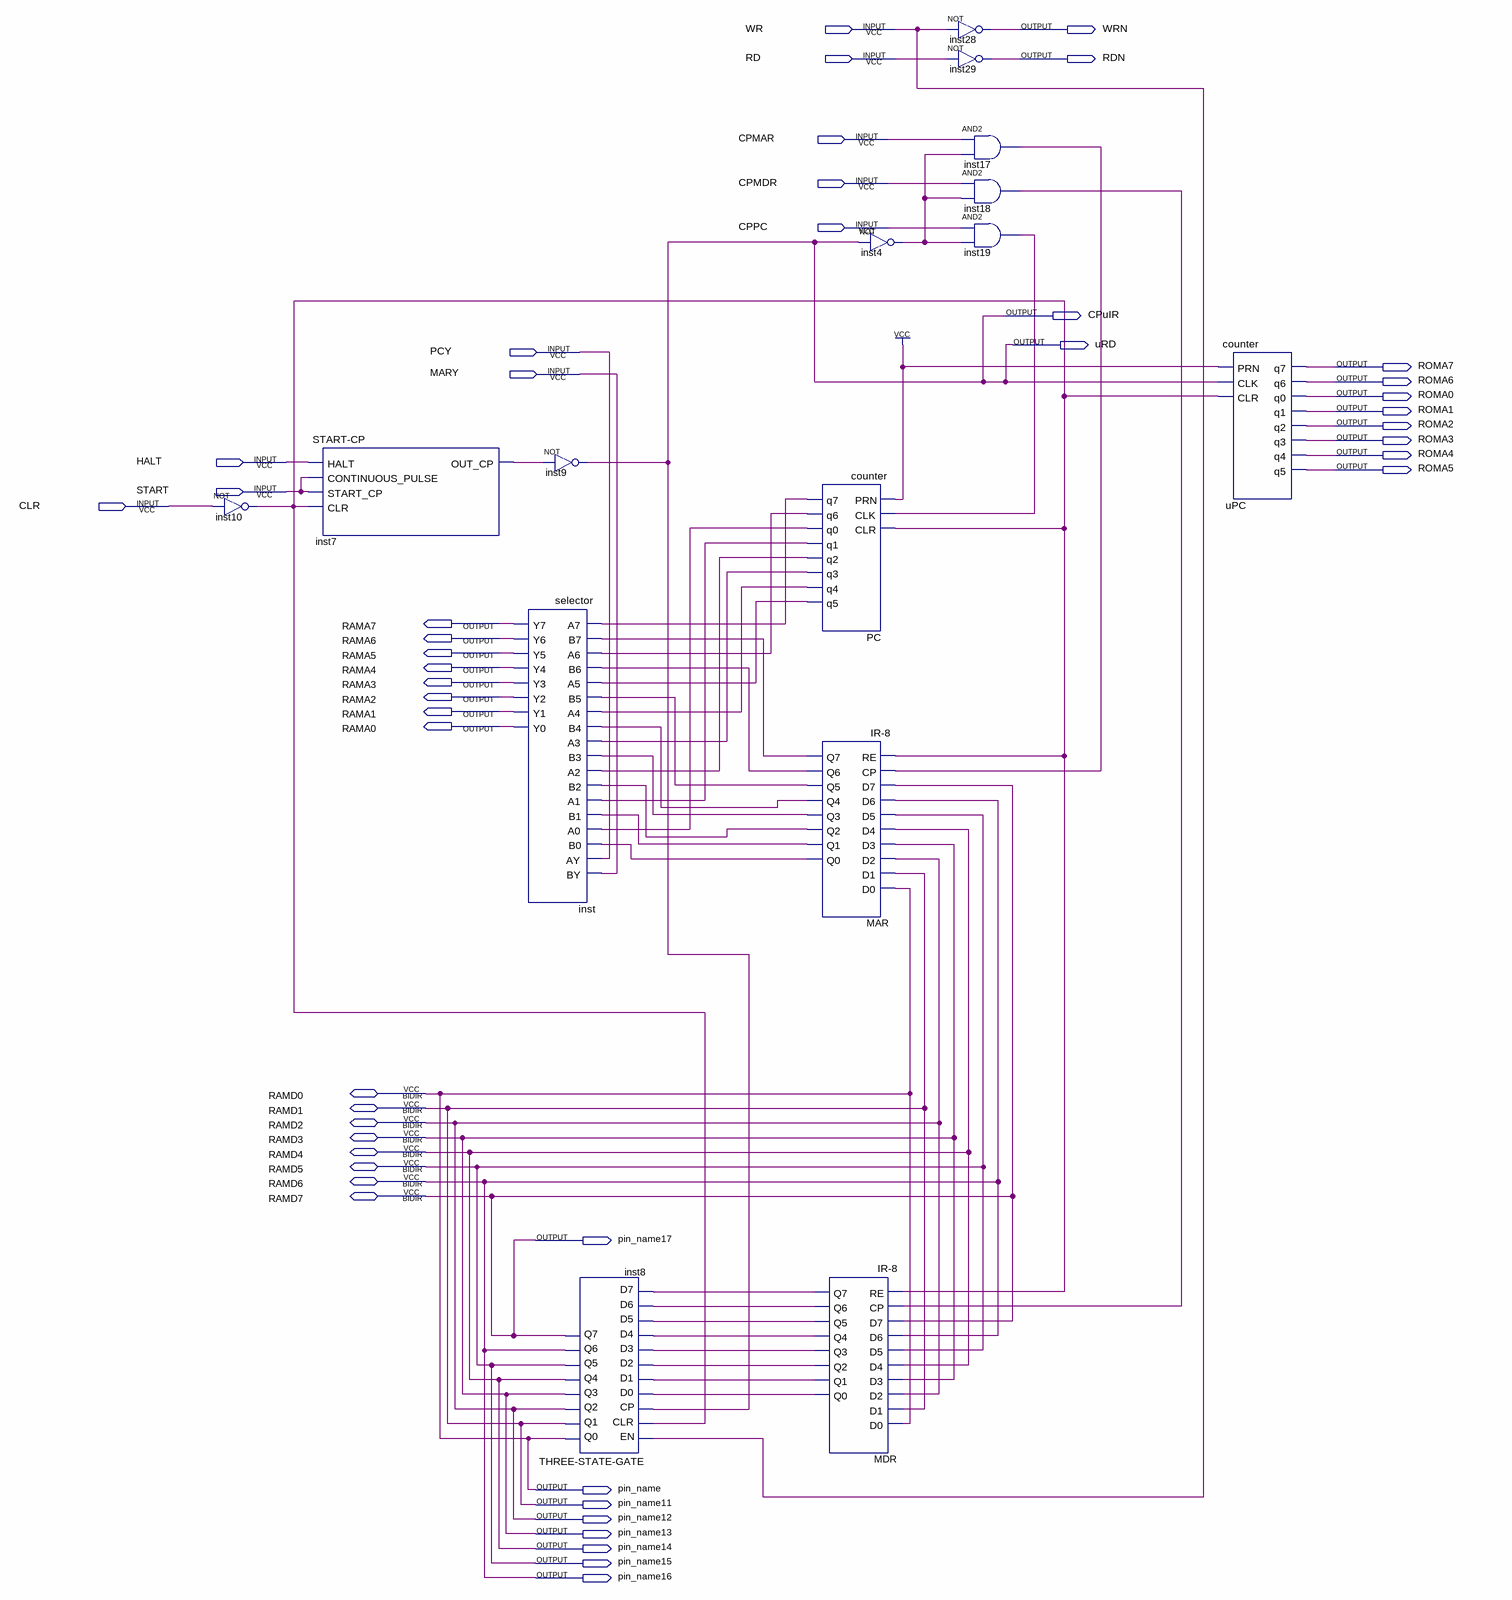
[diagram p0: schematic sheet]
// Quartus schematic FANGCUN-SYSTEM.bdf as structural Verilog: 15 symbols, 46 pins
module \FANGCUN-SYSTEM  (
  input  WR,
  input  RD,
  input  CPMAR,
  input  CPMDR,
  input  CPPC,
  input  PCY,
  input  MARY,
  input  HALT,
  input  START,
  input  CLR,
  inout  RAMD0,
  inout  RAMD1,
  inout  RAMD2,
  inout  RAMD3,
  inout  RAMD4,
  inout  RAMD5,
  inout  RAMD6,
  inout  RAMD7,
  output WRN,
  output RDN,
  output CPuIR,
  output uRD,
  output ROMA7,
  output ROMA6,
  output ROMA0,
  output ROMA1,
  output ROMA2,
  output ROMA3,
  output ROMA4,
  output ROMA5,
  output RAMA7,
  output RAMA6,
  output RAMA5,
  output RAMA4,
  output RAMA3,
  output RAMA2,
  output RAMA1,
  output RAMA0,
  output pin_name17,
  output pin_name,
  output pin_name11,
  output pin_name12,
  output pin_name13,
  output pin_name14,
  output pin_name15,
  output pin_name16
);

  wire inst4_out, inst7_out_cp, inst10_out, inst17_out, inst18_out, inst19_out, MAR_q0, MAR_q1, MAR_q2,
       MAR_q3, MAR_q4, MAR_q5, MAR_q6, MAR_q7, MDR_q0, MDR_q1, MDR_q2, MDR_q3, MDR_q4, MDR_q5, MDR_q6,
       MDR_q7, PC_q0, PC_q1, PC_q2, PC_q3, PC_q4, PC_q5, PC_q6, PC_q7;

  not inst10 (inst10_out, CLR);
  \START-CP  inst7 (.HALT(HALT), .CONTINUOUS_PULSE(START), .START_CP(START), .CLR(inst10_out), .OUT_CP(inst7_out_cp));
  not inst9 (CPuIR, inst7_out_cp);
  selector inst (
    .A7(PC_q7), .B7(MAR_q7), .A6(PC_q6), .B6(MAR_q6), .A5(PC_q5), .B5(MAR_q5), .A4(PC_q4), .B4(MAR_q4),
    .A3(PC_q3), .B3(MAR_q3), .A2(PC_q2), .B2(MAR_q2), .A1(PC_q1), .B1(MAR_q1), .A0(PC_q0), .B0(MAR_q0),
    .AY(PCY), .BY(MARY), .Y7(RAMA7), .Y6(RAMA6), .Y5(RAMA5), .Y4(RAMA4), .Y3(RAMA3), .Y2(RAMA2), .Y1(RAMA1),
    .Y0(RAMA0));
  \THREE-STATE-GATE  inst8 (
    .EN(WR), .CLR(inst10_out), .CP(CPuIR), .D0(MDR_q0), .D1(MDR_q1), .D2(MDR_q2), .D3(MDR_q3), .D4(MDR_q4),
    .D5(MDR_q5), .D6(MDR_q6), .D7(MDR_q7), .Q0(RAMD0), .Q1(RAMD1), .Q2(RAMD2), .Q3(RAMD3), .Q4(RAMD4),
    .Q5(RAMD5), .Q6(RAMD6), .Q7(RAMD7));
  not inst4 (inst4_out, CPuIR);
  counter PC (
    .PRN(1'b1), .CLK(inst19_out), .CLR(inst10_out), .q7(PC_q7), .q6(PC_q6), .q0(PC_q0), .q1(PC_q1),
    .q2(PC_q2), .q3(PC_q3), .q4(PC_q4), .q5(PC_q5));
  \IR-8  MAR (
    .RE(inst10_out), .CP(inst17_out), .D7(RAMD7), .D6(RAMD6), .D5(RAMD5), .D4(RAMD4), .D3(RAMD3), .D2(RAMD2),
    .D1(RAMD1), .D0(RAMD0), .Q7(MAR_q7), .Q6(MAR_q6), .Q5(MAR_q5), .Q4(MAR_q4), .Q3(MAR_q3), .Q2(MAR_q2),
    .Q1(MAR_q1), .Q0(MAR_q0));
  \IR-8  MDR (
    .RE(inst10_out), .CP(inst18_out), .D7(RAMD7), .D6(RAMD6), .D5(RAMD5), .D4(RAMD4), .D3(RAMD3), .D2(RAMD2),
    .D1(RAMD1), .D0(RAMD0), .Q7(MDR_q7), .Q6(MDR_q6), .Q5(MDR_q5), .Q4(MDR_q4), .Q3(MDR_q3), .Q2(MDR_q2),
    .Q1(MDR_q1), .Q0(MDR_q0));
  not inst28 (WRN, WR);
  not inst29 (RDN, RD);
  and inst17 (inst17_out, CPMAR, inst4_out);
  and inst18 (inst18_out, CPMDR, inst4_out);
  and inst19 (inst19_out, CPPC, inst4_out);
  counter uPC (
    .PRN(1'b1), .CLK(CPuIR), .CLR(inst10_out), .q7(ROMA7), .q6(ROMA6), .q0(ROMA0), .q1(ROMA1), .q2(ROMA2),
    .q3(ROMA3), .q4(ROMA4), .q5(ROMA5));

  assign pin_name = RAMD0;
  assign pin_name11 = RAMD1;
  assign pin_name12 = RAMD2;
  assign pin_name13 = RAMD3;
  assign pin_name14 = RAMD4;
  assign pin_name15 = RAMD5;
  assign pin_name16 = RAMD6;
  assign pin_name17 = RAMD7;
  assign uRD = CPuIR;
endmodule
